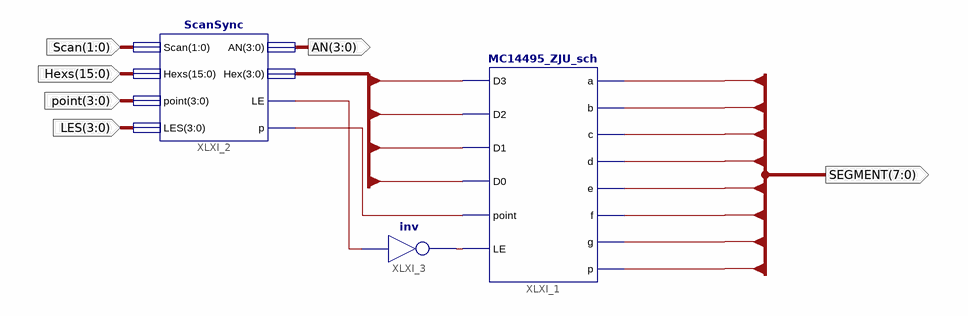
[diagram p0: schematic sheet 1]
// Xilinx ISE schematic Seg7_Dev.sch (spartan3) as structural Verilog: 3 symbols, 6 ports
module Seg7_Dev (
  input  [1:0] Scan,
  input  [15:0] Hexs,
  input  [3:0] point,
  input  [3:0] LES,
  output [3:0] AN,
  output [7:0] SEGMENT
);

  wire XLXN_7, XLXN_8, XLXN_9;
  wire [3:0] Hex;

  MC14495_ZJU_sch XLXI_1 (
    .D3(Hex[3]), .D2(Hex[2]), .D1(Hex[1]), .D0(Hex[0]), .point(XLXN_7), .LE(XLXN_9), .a(SEGMENT[0]),
    .b(SEGMENT[1]), .c(SEGMENT[2]), .d(SEGMENT[3]), .e(SEGMENT[4]), .f(SEGMENT[5]), .g(SEGMENT[6]),
    .p(SEGMENT[7]));
  ScanSync XLXI_2 (.Scan(Scan), .Hexs(Hexs), .point(point), .LES(LES), .AN(AN), .Hex(Hex), .LE(XLXN_8), .p(XLXN_7));
  not XLXI_3 (XLXN_9, XLXN_8);
endmodule
